# EAGLE design smd_res_breakout (EAGLE 6.4)
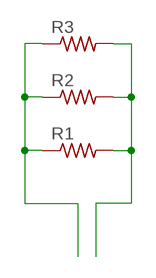
[diagram p0: schematic, sheet 1]

## Parts
R1  R-US_R1206  [R1206]
R2  R-US_R0805  [R0805]
R3  R-US_R0603  [R0603]

## Nets
1: R1.1 R2.1 R3.1
2: R1.2 R2.2 R3.2

## Library data of the parts
R1-R3 = rcl:R-US_: RESISTOR, American symbol

## Board
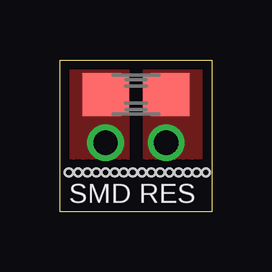
[diagram p1: board, top side]
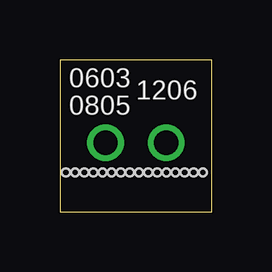
[diagram p2: board, bottom side, seen from below]

Size 6.35 x 6.35 mm. Coordinates in mm from the lower left corner, seen from the top.
Outline: 0,6.35 6.35,6.35 6.35,0 0,0 0,6.35
Copper layers (1*16): Top 0.035mm / dielectric 1.5mm / Bottom 0.035mm
Design rules "default *": minimum track width 10mil, minimum drill 24mil, track to track 8mil, track to pad 8mil, pad to pad 8mil, via to via 8mil, smd to smd 8mil, copper to edge 15mil, drill to drill 8mil, minimum pad ring 10mil, minimum via ring 8mil, stop-mask expansion 4mil, vias tented up to drill 0mil, thermal gap 8mil
Holes 0.33 mm at 0.38,1.65 0.76,1.65 1.14,1.65 1.52,1.65 1.9,1.65 2.29,1.65 2.67,1.65 3.05,1.65 3.43,1.65 3.81,1.65 4.19,1.65 4.57,1.65 4.95,1.65 5.33,1.65 5.71,1.65 6.1,1.65

### Footprints (pad centres in the part's own frame; a part is rotated, then mirrored left to right if it is on the bottom)
R1206 = smd 1.6 x 1.803: 1 -1.422,0; 2 1.422,0
R0805 = smd 1.3 x 1.5: 1 -0.95,0; 2 0.95,0
R0603 = smd 1 x 1.1: 1 -0.85,0; 2 0.85,0

### Placement (x,y rotation side)
R1  3.17,4.9 180 top
R2  3.17,4.9 180 top
R3  3.17,4.9 180 top

### Tracks (layer width: path | path; a pad name or v marks a point on that pad's centre or on a via)
1  (via drill 1.02)
  other vias: 4.45,2.9
  pour Top (no thermals): 6.22,6.22 3.56,6.22 3.56,2.16 6.22,2.16
2  (via drill 1.02)
  other vias: 1.9,2.9
  pour Top (no thermals): 0.13,6.22 2.79,6.22 2.79,2.16 0.13,2.16

### Text on the board
tPlace: SMD RES
bPlace: 1206 | 0603 | 0805